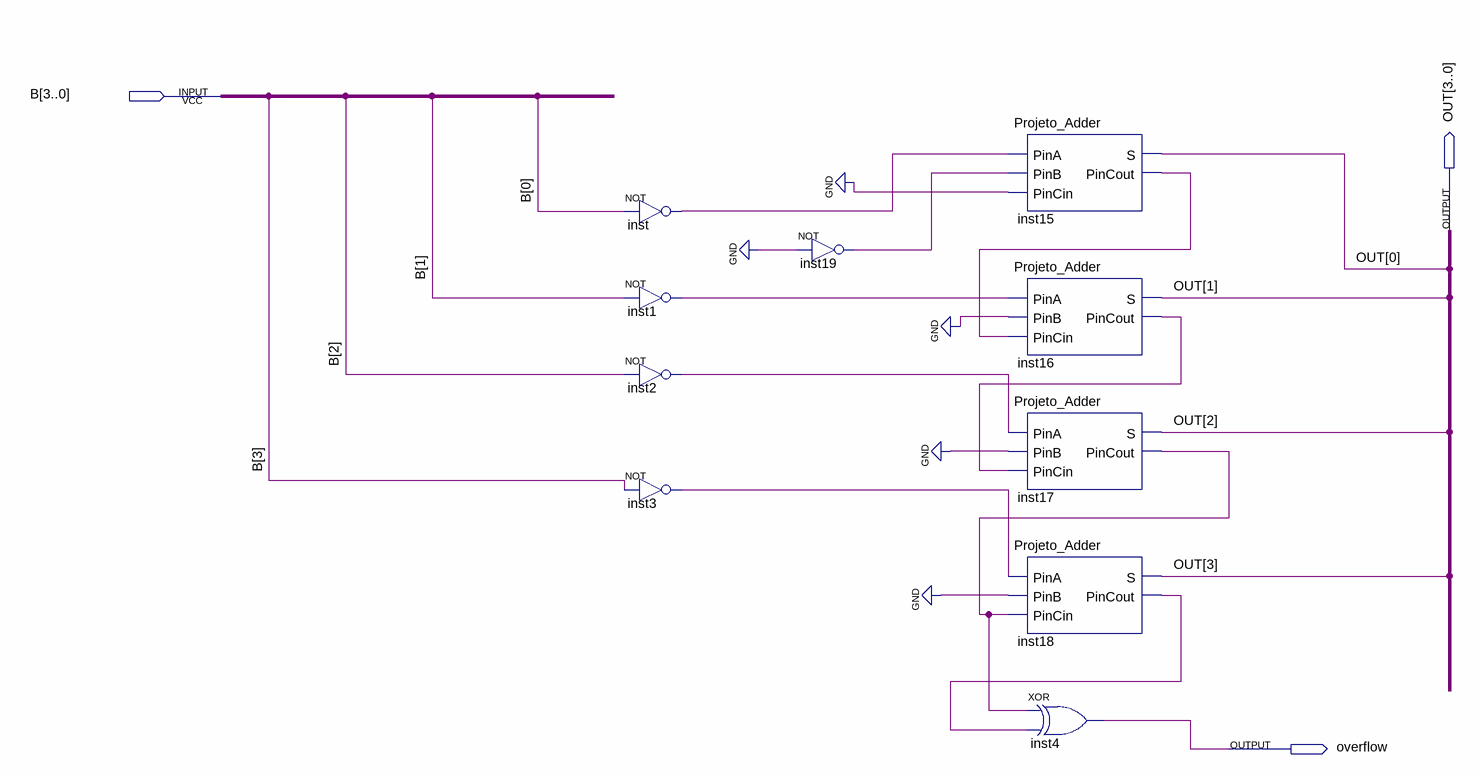
[diagram p0: schematic sheet]
// Quartus schematic Complemento_2.bdf as structural Verilog: 10 symbols, 3 pins
module Complemento_2 (
  input  [3:0] B,
  output [3:0] OUT,
  output overflow
);

  wire inst1_out, inst2_out, inst3_out, inst15_pincout, inst16_pincout, inst17_pincout, inst18_pincout,
       inst19_out, inst_out;

  not inst (inst_out, B[0]);
  not inst1 (inst1_out, B[1]);
  not inst2 (inst2_out, B[2]);
  not inst3 (inst3_out, B[3]);
  not inst19 (inst19_out, 1'b0);
  Projeto_Adder inst15 (.PinA(inst_out), .PinB(inst19_out), .PinCin(1'b0), .S(OUT[0]), .PinCout(inst15_pincout));
  Projeto_Adder inst16 (.PinA(inst1_out), .PinB(1'b0), .PinCin(inst15_pincout), .S(OUT[1]), .PinCout(inst16_pincout));
  Projeto_Adder inst17 (.PinA(inst2_out), .PinB(1'b0), .PinCin(inst16_pincout), .S(OUT[2]), .PinCout(inst17_pincout));
  Projeto_Adder inst18 (.PinA(inst3_out), .PinB(1'b0), .PinCin(inst17_pincout), .S(OUT[3]), .PinCout(inst18_pincout));
  xor inst4 (overflow, inst17_pincout, inst18_pincout);
endmodule
